# Altium schematic sheet 7_ICM20948.schdoc.schdoc
size 309 x 223 mm; Symbol: Sheet-Symbol_A4; Device: Sheet-Symbol_A4; @Page Name: ICM20948; @Create Date: 2023-12-01; @Page Count: 5; @Page No: 5; @Project Name: STM32F722RET6; @Schematic Name: 开发板; @Update Date: 2023-12-01; Company: 嘉立创EDA; Page Size: A4; Version: V1.0
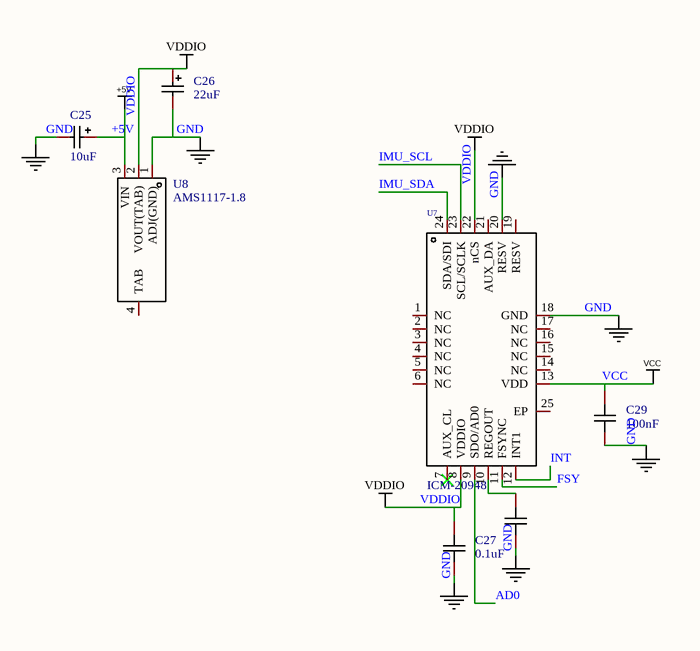
[diagram p0: 7_ICM20948.schdoc.schdoc]

## Parts
C25  10uF  [CAP-SMD_L3.2-W1.6-RD-C7171]
C26  22uF  [CASE-A_3216]
C27  0.1uF  [C0603]
C28  0.1uF  [C0603]  (value not drawn)
C29  100nF  [C0603]
U7  ICM-20948  [QFN-24_L3.0-W3.0-P0.40-BL-EP]
U8  AMS1117-1.8  [SOT-223_L6.7-W3.5-P2.30-BR]

## Nets
+5V: C25.1 U8.3(VIN)
GND: C25.2 C26.2 C27.2 C28.2 C29.2 U7.18(GND) U7.20(RESV) U8.1(ADJ(GND))
VCC: C29.1 U7.13(VDD)
VDDIO: C26.1 C27.1 U7.8(VDDIO) U7.22(nCS) U8.2(VOUT(TAB))
AD0: U7.9(SDO/AD0)
FSY: U7.11(FSYNC)
IMU_SCL: U7.23(SCL/SCLK)
IMU_SDA: U7.24(SDA/SDI)
INT: U7.12(INT1)
NetC28_1: C28.1 U7.10(REGOUT)

Not connected (* = marked no-connect by the designer): U7 1(NC) 2(NC) 3(NC) 4(NC) 5(NC) 6(NC) 7(AUX_CL)* 14(NC) 15(NC) 16(NC) 17(NC) 19(RESV) 21(AUX_DA) 25(EP); U8 4(TAB)

## Notes on the sheet
- 1
- 2
- 3
- 4
- 5
- 6
- A
- B
- C
- 原理图
- 开发板
- 创建日期
- 更新日期
- 2023-12-01
- 审阅
- 绘制
- 图页
- ICM20948
- 物料编码
- STM32F722RET6
- D
- 版本
- 尺寸
- 页
- 共
- V1.0
- A4
- 嘉立创EDA

## Library data of the parts
C25 = TAJA106K016RNJ: 容值:10uF;精度:±10%;额定电压:16V;等效串联电阻:3Ω@100kHz;; Manufacturer: Kyocera AVX; Add into BOM: yes; Tolerance: ±10%; Rated Voltage: 16V; Name: 10uF; Symbol: TAJA106K016RNJ; Device: TAJA106K016RNJ; LCSC Part Name: 10uF ±10% 16V; Supplier Part: C7171; Manufacturer Part: TAJA106K016RNJ; Supplier Footprint: CASE-A-3216; JLCPCB Part Class: 基础库; Datasheet: https://atta.szlcsc.com/upload/public/pdf/source/20160107/1457707748093.pdf; Supplier: LCSC; Convert to PCB: yes; Value: 10uF; Equivalent Series Resistance(ESR): 3Ω@100kHz; Operating Temperature: -55℃~+125℃
C26 = TAJA226K010RNJ: 容值:22uF;精度:±10%;额定电压:10V;等效串联电阻:3Ω@100kHz;; Manufacturer: Kyocera AVX; Add into BOM: yes; Tolerance: ±10%; Rated Voltage: 10V; Name: 22uF; Symbol: TAJA226K010RNJ; Device: TAJA226K010RNJ; LCSC Part Name: 22uF ±10% 10V; Supplier Part: C11366; Manufacturer Part: TAJA226K010RNJ; Supplier Footprint: CASE-A-3216; JLCPCB Part Class: 扩展库; Datasheet: https://atta.szlcsc.com/upload/public/pdf/source/20160107/1457707744993.pdf; Supplier: LCSC; Convert to PCB: yes; Value: 22uF; Equivalent Series Resistance(ESR): 3Ω@100kHz; Operating Temperature: -55℃~+125℃
C27-C29 = CAP_0603: Symbol: CapAcitance; Convert to PCB: yes; Device: CAP_0603; Add into BOM: yes; Supplier Footprint: 0603
  C27 C28: Name: 0.1uF; Value: 0.1uF
  C29: Name: 100nF; Value: 100nF
U7 = ICM-20948: 传感器类型:加速度计陀螺仪;; Manufacturer: TDK InvenSense(应美盛); Add into BOM: yes; Name: ICM-20948; Symbol: ICM-20948; Device: ICM-20948; LCSC Part Name: ICM-20948; Supplier Part: C726001; Manufacturer Part: ICM-20948; Supplier Footprint: QFN-24(3x3); JLCPCB Part Class: 扩展库; Datasheet: https://atta.szlcsc.com/upload/public/pdf/source/20210715/C726001_EFE09342631EBC06FA98BEAE6CEEEE9D.pdf; Supplier: LCSC; Convert to PCB: yes; Sensor Type: 加速度计陀螺仪; Operating Temperature: -40℃~+85℃
U8 = AMS1117-1.8_C347220: 输出类型:固定;最大输入电压:18V;输出电压:1.8V;输出电流:1A;电源纹波抑制比(PSRR):60dB@(120Hz);输出极性:正;; Manufacturer: UMW(友台半导体); Add into BOM: yes; Output Type: 固定; Maximum Input Voltage: 18V; Output Voltage: 1.8V; Output Current: 1A; Dropout Voltage: 1.3V@(1A); Output Polarity: 正; Number of Outputs: 1; Name: AMS1117-1.8; Symbol: AMS1117-1.8_C347220; Device: AMS1117-1.8_C347220; LCSC Part Name: 输入18V 输出1.8V 1A; Supplier Part: C347220; Manufacturer Part: AMS1117-1.8; Supplier Footprint: SOT-223; JLCPCB Part Class: 扩展库; Datasheet: https://atta.szlcsc.com/upload/public/pdf/source/20231109/155D79A26D9DB04352555A58D5969DC8.pdf; Supplier: LCSC; Convert to PCB: yes; Power Supply Rejection Ratio (PSRR): 60dB@(120Hz); Quiescent Current (Ground Current): -; Noise: -; Feature: -; Operating Temperature: -